# EAGLE design node2 (EAGLE 5.07)
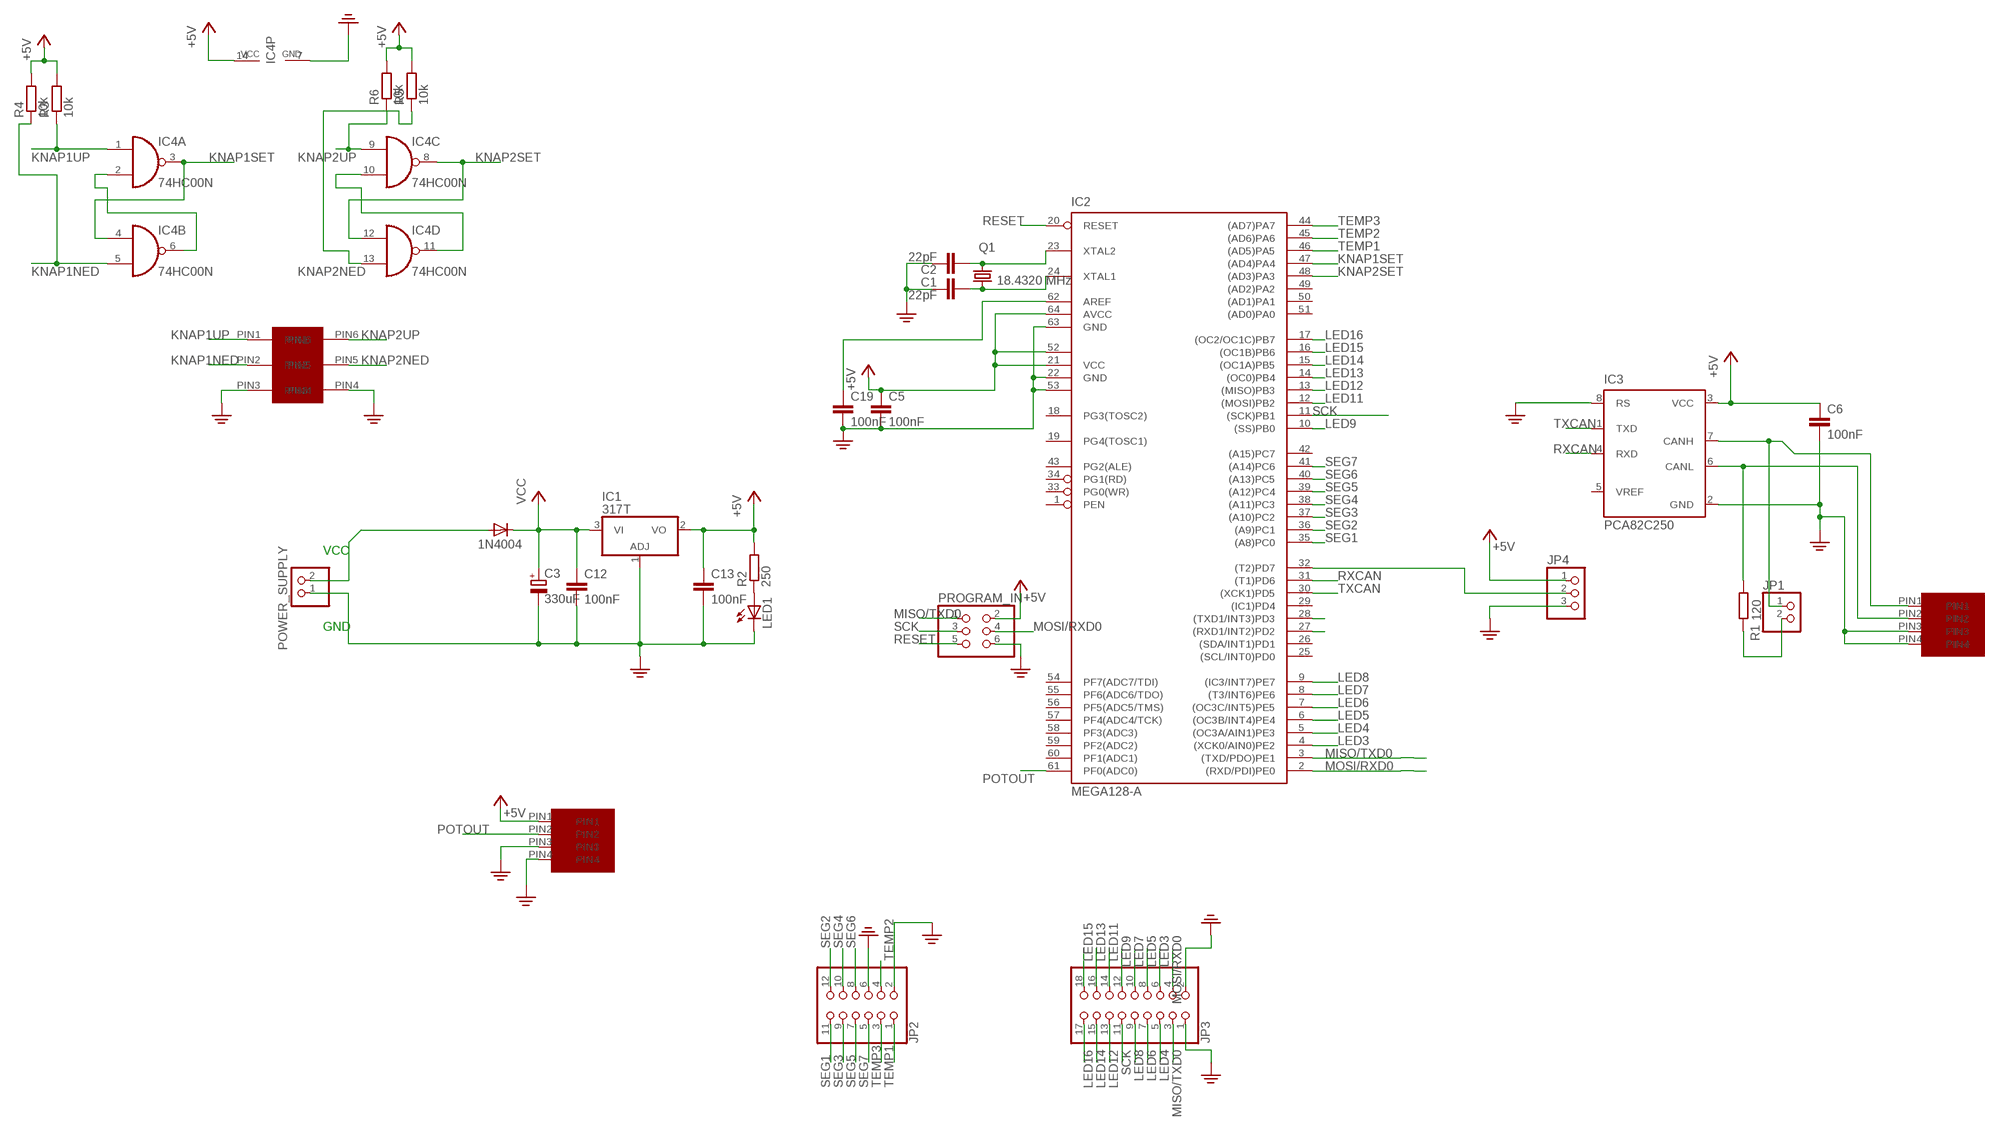
[diagram p0: schematic, sheet 1]

## Parts
C1  22pF  C5/2.5  [C5B2.5]
C2  22pF  C5/2.5  [C5B2.5]
C3  330uF  CPOL-EUE15-5AXIAL  [E15-5]
C5  100nF  C-EU050-024X044  [C050-024X044]
C6  100nF  C-EU050-024X044  [C050-024X044]
C12  100nF  C-EU050-024X044  [C050-024X044]
C13  100nF  C-EU050-024X044  [C050-024X044]
C19  100nF  C-EU050-024X044  [C050-024X044]
D1  1N4004  [DO41-10]
IC1  317T  [TO220H]
IC2  MEGA128-A  [TQFP64]
IC3  PCA82C250  [DIL08]
IC4  74HC00N  [DIL14]
JP1  PINHD-1X2  [1X02]
JP2  PINHD-2X6  [2X06]
JP3  PINHD-2X9  [2X09]
JP4  PINHD-1X3  [1X03]
LED1  LED5MM  [LED5MM]
POWER_SUPPLY  PINHD-1X2  [1X02]
PROGRAM_IN  PINHD-2X3  [2X03]
Q1  18.4320 MHz  CRYSTALHC49U70  [HC49U70]
R1  120  R-EU_0207/10  [0207/10]
R2  250  R-EU_0207/10  [0207/10]
R3  10k  R-EU_0207/10  [0207/10]
R4  10k  R-EU_0207/10  [0207/10]
R5  10k  R-EU_0207/10  [0207/10]
R6  10k  R-EU_0207/10  [0207/10]
U$1  MICROFIT4  [MICROFIT4SOCK]
U$4  MICROFIT6  [MICROFIT6SOCK]
U$5  MICROFIT4  [MICROFIT4SOCK]

## Nets
+5V: C5.1 C6.1 C13.1 IC1.2(VO) IC2.21(VCC) IC2.52(VCC1) IC2.64(AVCC) IC3.3(VCC) IC4.14(P:VCC) JP4.1 PROGRAM_IN.2 R2.2 R3.2 R4.2 R5.2 R6.2 U$5.PIN1
CANJUMP1: IC3.7(CANH) JP1.1 U$1.PIN1
CANJUMP2: JP1.2 R1.2
KNAP1NED: IC4.5(B:I1) R4.1 U$4.PIN2
KNAP1SET: IC2.47((AD4)PA4) IC4.3(A:O) IC4.4(B:I0)
KNAP1UP: IC4.1(A:I0) R3.1 U$4.PIN1
KNAP2NED: IC4.13(D:I1) R5.1 U$4.PIN5
KNAP2SET: IC2.48((AD3)PA3) IC4.8(C:O) IC4.12(D:I0)
KNAP2UP: IC4.9(C:I0) R6.1 U$4.PIN6
LED3: IC2.4((XCK0/AIN0)PE2) JP3.6
LED4: IC2.5((OC3A/AIN1)PE3) JP3.5
LED5: IC2.6((OC3B/INT4)PE4) JP3.8
LED6: IC2.7((OC3C/INT5)PE5) JP3.7
LED7: IC2.8((T3/INT6)PE6) JP3.10
LED8: IC2.9((IC3/INT7)PE7) JP3.9
LED9: IC2.10((SS)PB0) JP3.12
LED11: IC2.12((MOSI)PB2) JP3.14
LED12: IC2.13((MISO)PB3) JP3.13
LED13: IC2.14((OC0)PB4) JP3.16
LED14: IC2.15((OC1A)PB5) JP3.15
LED15: IC2.16((OC1B)PB6) JP3.18
LED16: IC2.17((OC2/OC1C)PB7) JP3.17
MISO/TXD0: IC2.3((TXD/PDO)PE1) JP3.3 PROGRAM_IN.1
MOSI/RXD0: IC2.2((RXD/PDI)PE0) JP3.4 PROGRAM_IN.4
N$1: C1.2 IC2.24(XTAL1) Q1.1
N$2: C2.2 IC2.23(XTAL2) Q1.2
N$4: IC2.32((T2)PD7) JP4.2
N$5: D1.A POWER_SUPPLY.2
N$6: LED1.A R2.1
N$7: IC2.27((RXD1/INT2)PD2)
N$10: C19.1 IC2.62(AREF)
N$12: IC2.28((TXD1/INT3)PD3)
N$13: IC4.2(A:I1) IC4.6(B:O)
N$15: IC4.10(C:I1) IC4.11(D:O)
N$51: IC3.6(CANL) R1.1 U$1.PIN2
PE: C1.1 C2.1 C3.- C5.2 C6.2 C12.2 C13.2 C19.2 IC1.1(ADJ) IC2.22(GND) IC2.53(GND1) IC2.63(GND) IC3.2(GND) IC3.8(RS) IC4.7(P:GND) JP2.2 JP2.6 JP3.1 JP3.2 JP4.3 LED1.K(C) POWER_SUPPLY.1 PROGRAM_IN.6 U$1.PIN3 U$1.PIN4 U$4.PIN3 U$4.PIN4 U$5.PIN3 U$5.PIN4
POTOUT: IC2.61(PF0(ADC0)) U$5.PIN2
RESET: IC2.20(RESET) PROGRAM_IN.5
RXCAN: IC2.31((T1)PD6) IC3.4(RXD)
SCK: IC2.11((SCK)PB1) JP3.11 PROGRAM_IN.3
SEG1: IC2.35((A8)PC0) JP2.11
SEG2: IC2.36((A9)PC1) JP2.12
SEG3: IC2.37((A10)PC2) JP2.9
SEG4: IC2.38((A11)PC3) JP2.10
SEG5: IC2.39((A12)PC4) JP2.7
SEG6: IC2.40((A13)PC5) JP2.8
SEG7: IC2.41((A14)PC6) JP2.5
TEMP1: IC2.46((AD5)PA5) JP2.1
TEMP2: IC2.45((AD6)PA6) JP2.4
TEMP3: IC2.44((AD7)PA7) JP2.3
TXCAN: IC2.30((XCK1)PD5) IC3.1(TXD)
VCC: C3.+ C12.1 D1.C IC1.3(VI)
Unconnected: IC2.1(PEN) IC2.18(PG3(TOSC2)) IC2.19(PG4(TOSC1)) IC2.25((SCL/INT0)PD0) IC2.26((SDA/INT1)PD1) IC2.29((IC1)PD4) IC2.33(PG0(WR)) IC2.34(PG1(RD)) IC2.42((A15)PC7) IC2.43(PG2(ALE)) IC2.49((AD2)PA2) IC2.50((AD1)PA1) IC2.51((AD0)PA0) IC2.54(PF7(ADC7/TDI)) IC2.55(PF6(ADC6/TDO)) IC2.56(PF5(ADC5/TMS)) IC2.57(PF4(ADC4/TCK)) IC2.58(PF3(ADC3)) IC2.59(PF2(ADC2)) IC2.60(PF1(ADC1)) IC3.5(VREF)

## Notes on the sheet
- VCC
- GND

## Library data of the parts
C1 C2 = capacitor-wima:C: CAPACITOR naming: grid - package width
C3 = rcl:CPOL-EU: POLARIZED CAPACITOR, European symbol
C5 C6 C12 C13 C19 = rcl:C-EU: CAPACITOR, European symbol
D1 = diode:1N4004: DIODE general purpose rectifier, 1 A
IC1 = linear:*317: Positive VOLTAGE REGULATOR
IC2 = atmel:MEGA128: MICROCONTROLLER 128 Kbytes FLASH 4 Kbytes SRAM 4 Kbytes EEPROM DUAL USART 8-channel 10 bit ADC Source: avr.lbr
IC3 = micro-philips:PCA82C250: CAN CONTROLLER INTERFACE
IC4 = 74xx-eu:74*00: Quad 2-input NAND gate
JP1 POWER_SUPPLY = pinhead:PINHD-1X2: PIN HEADER
JP2 = pinhead:PINHD-2X6: PIN HEADER
JP3 = pinhead:PINHD-2X9: PIN HEADER
JP4 = pinhead:PINHD-1X3: PIN HEADER
LED1 = led:LED: LED OSRAM: - CHIPLED LG R971, LG N971, LY N971, LG Q971, LY Q971, LO R971, LY R971 LH N974, LH R974 LS Q976, LO Q976, LY Q976 LO Q996 - Hyper CHIPLED LW Q18S LB Q993, LB Q99A, LB R99A - SideLED LS A670, LO A670, LY A670, LG A670, LP A670 LB A673, LV A673, LT A673, LW A673 LH A674 LY A675 LS A676, LA A676, LO A676, LY A676, LW A676 LS A679, LY A679, LG A679 - Hyper Micro SIDELED® LS Y876, LA Y876, LO Y876, LY Y876 LT Y87S - SmartLED LW L88C, LW L88S LB L89C, LB L89S, LG L890 LS L89K, LO L89K, LY L89K LS L896, LA L896, LO L896, LY L896 - TOPLED LS T670, LO T670, LY T670, LG T670, LP T670 LSG T670, LSP T670, LSY T670, LOP T670, LYG T670 LG T671, LOG T671, LSG T671 LB T673, LV T673, LT T673, LW T673 LH T674 LS T676, LA T676, LO T676, LY T676, LB T676, LH T676, LSB T676, LW T676 LB T67C, LV T67C, LT T67C, LS T67K, LO T67K, LY T67K, LW E67C LS E67B, LA E67B, LO E67B, LY E67B, LB E67C, LV E67C, LT E67C LW T67C LS T679, LY T679, LG T679 LS T770, LO T770, LY T770, LG T770, LP T770 LB T773, LV T773, LT T773, LW T773 LH T774 LS E675, LA E675, LY E675, LS T675 LS T776, LA T776, LO T776, LY T776, LB T776 LHGB T686 LT T68C, LB T68C - Hyper Mini TOPLED® LB M676 - Mini TOPLED Santana® LG M470 LS M47K, LO M47K, LY M47K Source: http://www.osram.convergy.de LUXEON: - LUMILED® LXK2-PW12-R00, LXK2-PW12-S00, LXK2-PW14-U00, LXK2-PW14-V00 LXK2-PM12-R00, LXK2-PM12-S00, LXK2-PM14-U00 LXK2-PE12-Q00, LXK2-PE12-R00, LXK2-PE12-S00, LXK2-PE14-T00, LXK2-PE14-U00 LXK2-PB12-K00, LXK2-PB12-L00, LXK2-PB12-M00, LXK2-PB14-N00, LXK2-PB14-P00, LXK2-PB14-Q00 LXK2-PR12-L00, LXK2-PR12-M00, LXK2-PR14-Q00, LXK2-PR14-R00 LXK2-PD12-Q00, LXK2-PD12-R00, LXK2-PD12-S00 LXK2-PH12-R00, LXK2-PH12-S00 LXK2-PL12-P00, LXK2-PL12-Q00, LXK2-PL12-R00 Source: www.luxeon.com KINGBRIGHT: KA-3528ASYC Source: www.kingbright.com
PROGRAM_IN = pinhead:PINHD-2X3: PIN HEADER
Q1 = crystal:CRYSTAL: CRYSTAL
R1-R6 = resistor:R-EU_: RESISTOR, European symbol
U$1 U$5 = UNICORN:MICROFIT4
U$4 = UNICORN:MICROFIT6

## Board
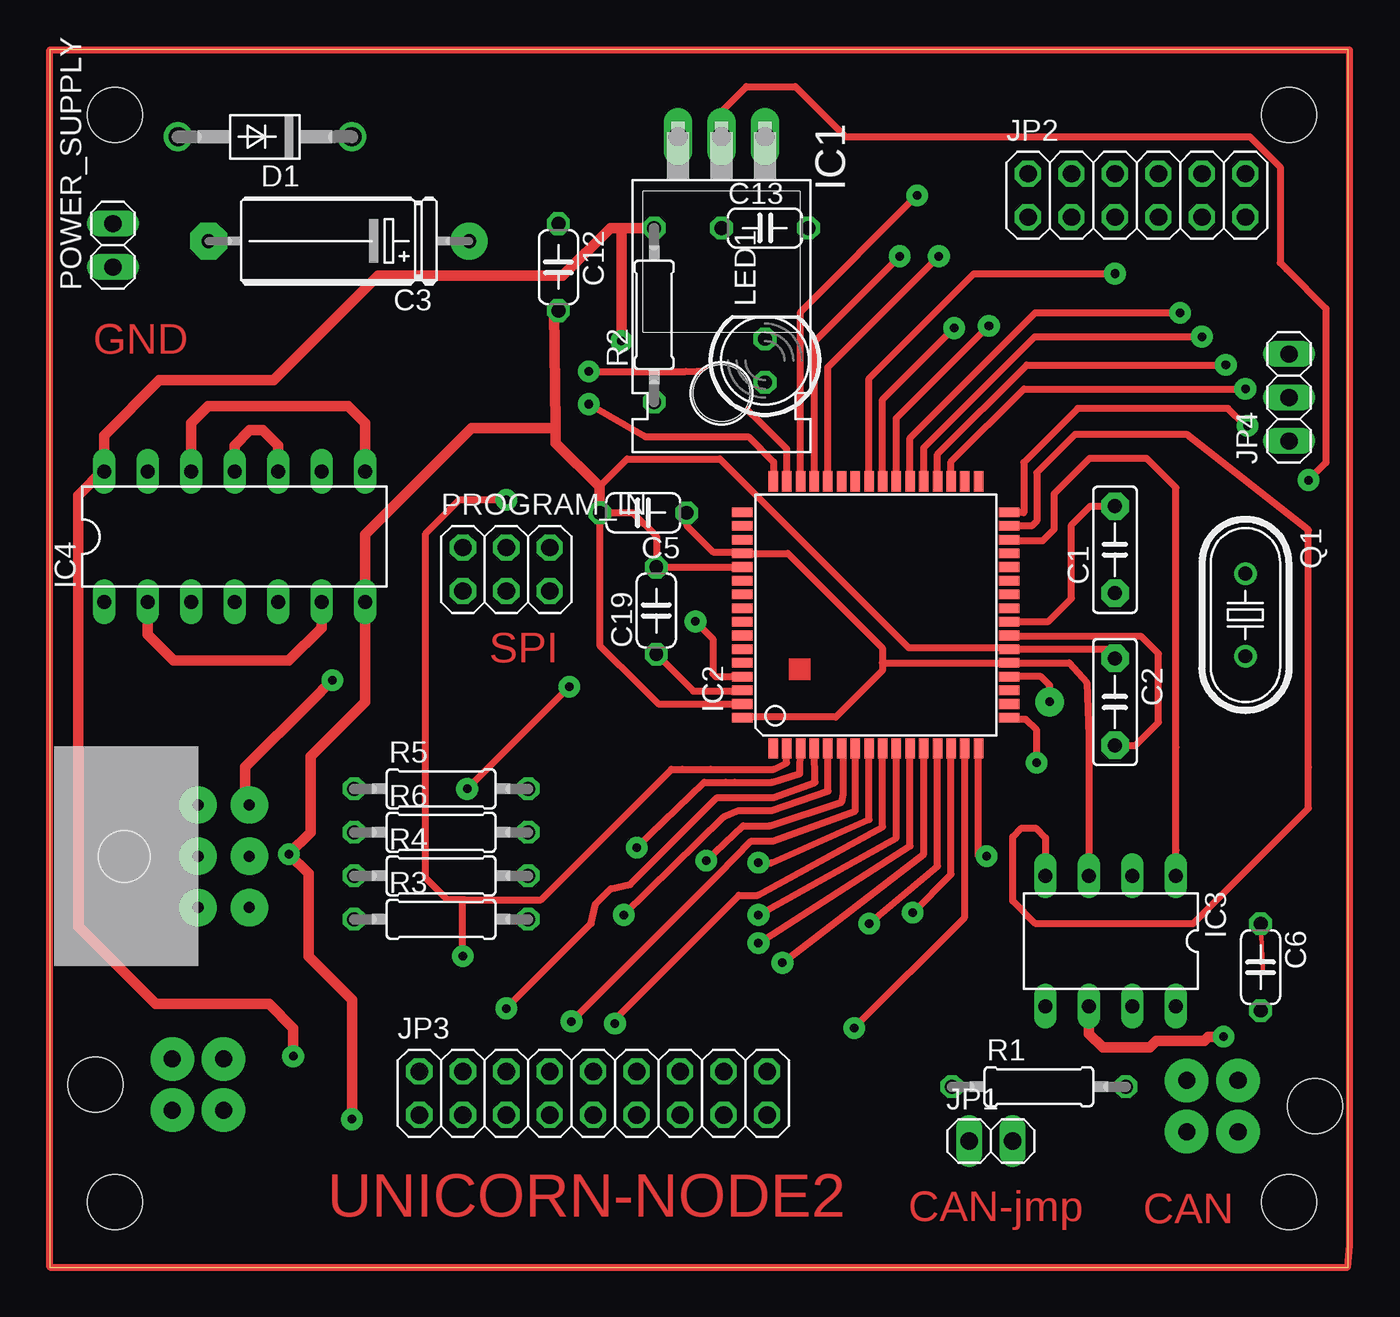
[diagram p1: board, top side]
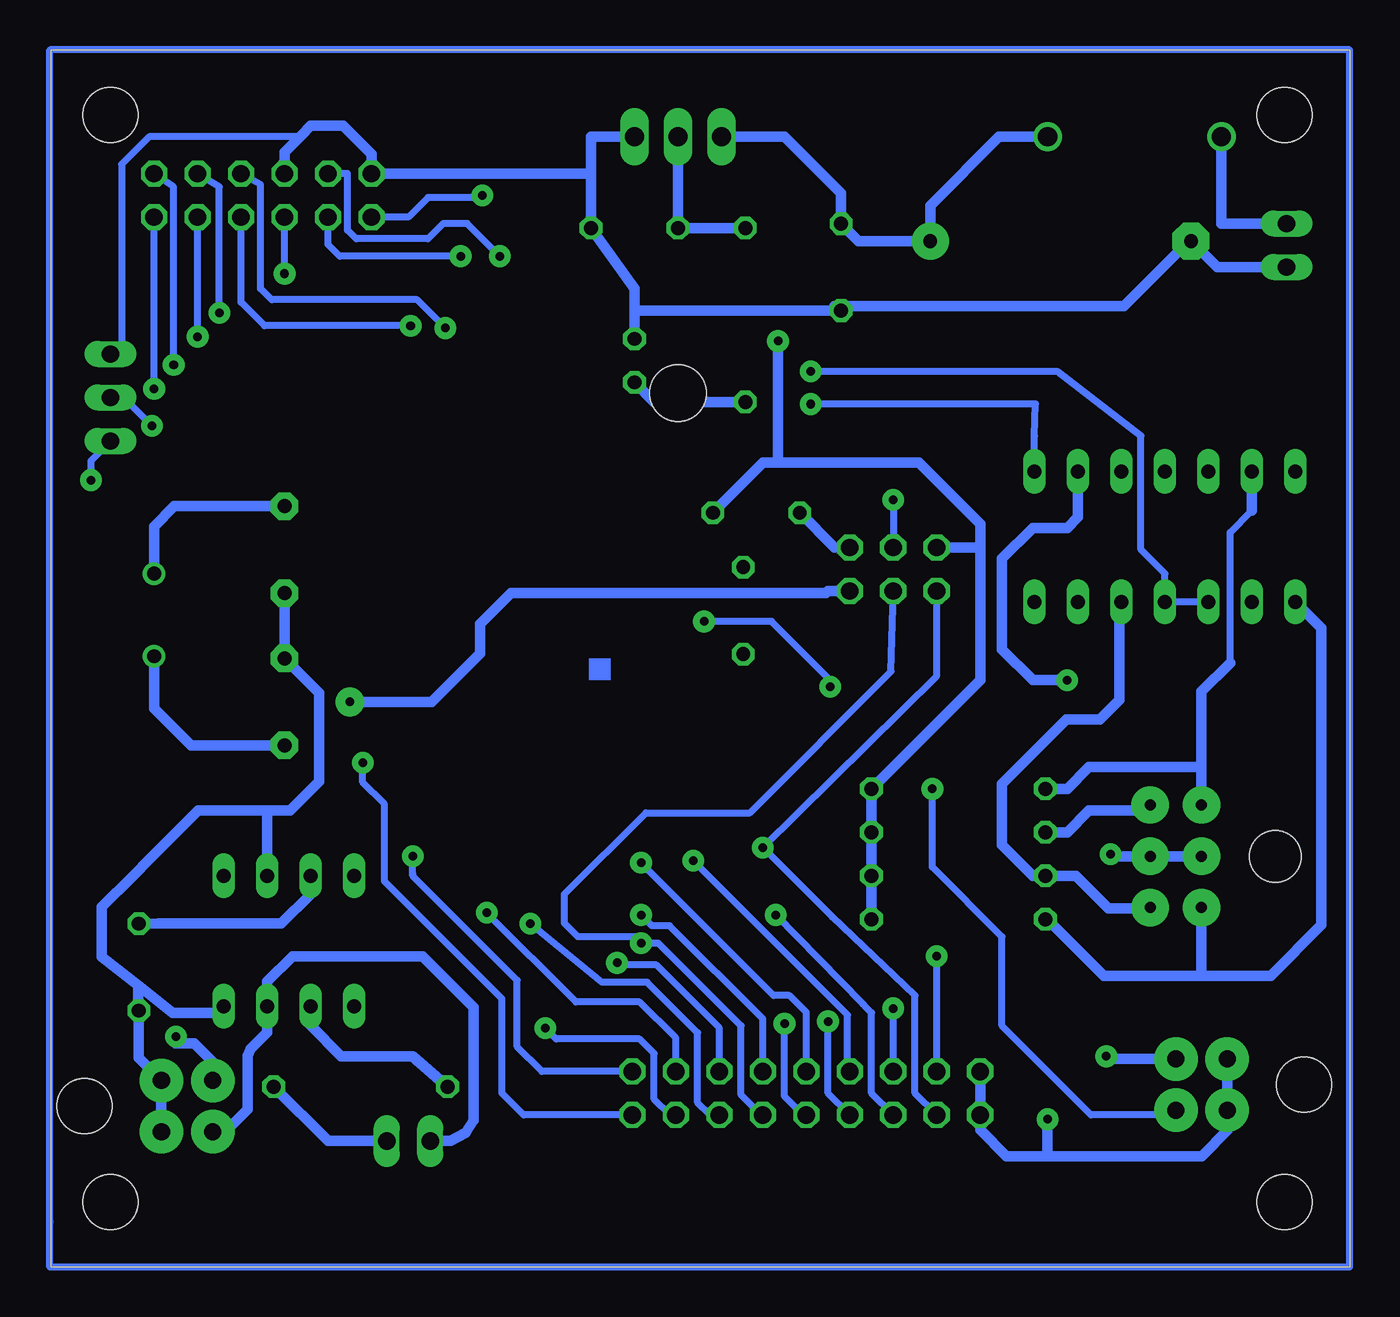
[diagram p2: board, bottom side, seen from below]

Size 75.87 x 71.11 mm. Coordinates in mm from the lower left corner, seen from the top.
Outline: 0,0 75.87,0 75.87,71.11 0,71.11 0,0
Copper layers (1*16): Top 0.035mm / dielectric 1.5mm / Bottom 0.035mm
Design rules "default": minimum track width 10mil, minimum drill 24mil, track to track 8mil, track to pad 8mil, pad to pad 8mil, via to via 8mil, smd to smd 8mil, copper to edge 40mil, drill to drill 8mil, minimum pad ring 10mil, minimum via ring 8mil, stop-mask expansion 4mil, vias tented up to drill 0mil, thermal gap 10mil
Holes 3.2 mm at 3.81,3.81 3.81,67.31 72.39,67.31 72.39,3.81

### Footprints (pad centres in the part's own frame; a part is rotated, then mirrored left to right if it is on the bottom)
C5B2.5 = drill 0.813 pad 1.6 octagon: 1 -2.54,0; 2 2.54,0
E15-5 = drill 0.813 pad 2.159 round: + -7.62,0 | drill 0.813 pad 2.159 octagon: - 7.62,0
C050-024X044 = drill 0.813 octagon: 1 -2.54,0; 2 2.54,0
DO41-10 = drill 1.118 round: A 5.08,0; C -5.08,0
TO220H = drill 1.118 long: 1 -2.54,-10.16; 2 0,-10.16; 3 2.54,-10.16 | hole 3.302: 0,4.826
TQFP64 = smd 1.194 x 0.559: 1 -7.8,6; 2 -7.8,5.2; 3 -7.8,4.4; 4 -7.8,3.6; 5 -7.8,2.8; 6 -7.8,2; 7 -7.8,1.2; 8 -7.8,0.4; 9 -7.8,-0.4; 10 -7.8,-1.2; 11 -7.8,-2; 12 -7.8,-2.8; 13 -7.8,-3.6; 14 -7.8,-4.4; 15 -7.8,-5.2; 16 -7.8,-6; 33 7.8,-6; 34 7.8,-5.2; 35 7.8,-4.4; 36 7.8,-3.6; 37 7.8,-2.8; 38 7.8,-2; 39 7.8,-1.2; 40 7.8,-0.4; 41 7.8,0.4; 42 7.8,1.2; 43 7.8,2; 44 7.8,2.8; 45 7.8,3.6; 46 7.8,4.4; 47 7.8,5.2; 48 7.8,6 | smd 0.559 x 1.194: 17 -6,-7.8; 18 -5.2,-7.8; 19 -4.4,-7.8; 20 -3.6,-7.8; 21 -2.8,-7.8; 22 -2,-7.8; 23 -1.2,-7.8; 24 -0.4,-7.8; 25 0.4,-7.8; 26 1.2,-7.8; 27 2,-7.8; 28 2.8,-7.8; 29 3.6,-7.8; 30 4.4,-7.8; 31 5.2,-7.8; 32 6,-7.8; 49 6,7.8; 50 5.2,7.8; 51 4.4,7.8; 52 3.6,7.8; 53 2.8,7.8; 54 2,7.8; 55 1.2,7.8; 56 0.4,7.8; 57 -0.4,7.8; 58 -1.2,7.8; 59 -2,7.8; 60 -2.8,7.8; 61 -3.6,7.8; 62 -4.4,7.8; 63 -5.2,7.8; 64 -6,7.8
DIL08 = drill 0.813 long: 1 -3.81,-3.81; 2 -1.27,-3.81; 3 1.27,-3.81; 4 3.81,-3.81; 5 3.81,3.81; 6 1.27,3.81; 7 -1.27,3.81; 8 -3.81,3.81
DIL14 = drill 0.813 long: 1 -7.62,-3.81; 2 -5.08,-3.81; 3 -2.54,-3.81; 4 0,-3.81; 5 2.54,-3.81; 6 5.08,-3.81; 7 7.62,-3.81; 8 7.62,3.81; 9 5.08,3.81; 10 2.54,3.81; 11 0,3.81; 12 -2.54,3.81; 13 -5.08,3.81; 14 -7.62,3.81
1X02 = drill 1.016 long: 1 -1.27,0; 2 1.27,0
2X06 = drill 1.016 octagon: 1 -6.35,-1.27; 2 -6.35,1.27; 3 -3.81,-1.27; 4 -3.81,1.27; 5 -1.27,-1.27; 6 -1.27,1.27; 7 1.27,-1.27; 8 1.27,1.27; 9 3.81,-1.27; 10 3.81,1.27; 11 6.35,-1.27; 12 6.35,1.27
2X09 = drill 1.016 octagon: 1 -10.16,-1.27; 2 -10.16,1.27; 3 -7.62,-1.27; 4 -7.62,1.27; 5 -5.08,-1.27; 6 -5.08,1.27; 7 -2.54,-1.27; 8 -2.54,1.27; 9 0,-1.27; 10 0,1.27; 11 2.54,-1.27; 12 2.54,1.27; 13 5.08,-1.27; 14 5.08,1.27; 15 7.62,-1.27; 16 7.62,1.27; 17 10.16,-1.27; 18 10.16,1.27
1X03 = drill 1.016 long: 1 -2.54,0; 2 0,0; 3 2.54,0
LED5MM = drill 0.813 octagon: A -1.27,0; K 1.27,0
2X03 = drill 1.016 octagon: 1 -2.54,-1.27; 2 -2.54,1.27; 3 0,-1.27; 4 0,1.27; 5 2.54,-1.27; 6 2.54,1.27
HC49U70 = drill 0.813 round: 1 -2.413,0; 2 2.413,0
0207/10 = drill 0.813 octagon: 1 -5.08,0; 2 5.08,0
MICROFIT4SOCK = drill 1 pad 2.54 round: PIN1 -2,0; PIN2 1,0; PIN3 -2,-3; PIN4 1,-3 | hole 3.2: -0.5,-7.5
MICROFIT6SOCK = drill 0.64 pad 2.184 round: PIN1 3,-1.5; PIN2 3,1.5; PIN3 0,-1.5; PIN4 0,1.5; PIN5 -3,-1.5; PIN6 -3,1.5 | hole 3: 0,-5.8

### Placement (x,y rotation side)
C1  62.23,41.91 90 top
C2  62.23,33.02 270 top
C3  16.89,59.94 180 top
C5  34.67,44.07 180 top
C6  70.74,17.53 270 top
C12  29.72,58.42 270 top
C13  41.78,60.71 0 top
C19  35.43,38.35 90 top
D1  12.57,66.04 180 top
IC1  39.24,55.88 180 top
IC2  48.26,38.1 90 top
IC3  61.98,19.05 180 top
IC4  10.79,42.67 0 top
JP1  54.99,7.37 0 top
JP2  63.5,62.61 0 top
JP3  31.75,10.16 0 top
JP4  72.39,50.8 90 top
LED1  41.78,52.96 90 top
POWER_SUPPLY  3.68,59.69 90 top
PROGRAM_IN  26.67,40.77 0 top
Q1  69.85,38.1 270 top
R1  57.78,10.54 0 top
R2  35.31,55.63 90 top
R3  22.86,20.32 0 top
R4  22.86,22.86 0 top
R5  22.86,27.94 0 top
R6  22.86,25.4 0 top
U$1  66.42,9.91 90 top
U$4  10.16,24 270 top
U$5  10.16,10.16 270 top

### Tracks (layer width: path | path; a pad name or v marks a point on that pad's centre or on a via)
+5V  (via drill 0.5 pad 1.27)
  Top 0.254: C6.1 70.87,17.4
  Top 0.406: C5.1 37.21,43.33 38.76,41.78 40.46,41.78 IC2.52 43.12,41.7 48.64,36.17 48.64,35.31 | IC2.21 59.56,35.31 60.58,34.16 60.71,31.01 60.71,24.25 IC3.3 60.71,23.98 | IC2.21 | 48.64,35.31 IC2.21 | 40.46,32.13 IC2.64 40.46,32.13 | 40.46,32.13 45.92,32.13 48.64,34.85 48.64,35.31 | v73.53,45.97 74.55,46.99 74.55,48.26 74.55,56.01 72.26,58.29 71.88,58.67 71.88,64.27 70.11,66.04 46.48,66.04 46.1,66.42 43.56,68.96 40.69,68.96 39.24,67.51 IC1.2
  Top 0.61: 33.4,60.71 32.77,60.71 29.97,57.91 19.18,57.91 13.08,51.82 6.41,51.82 3.17,48.58 IC4.14 3.17,46.61 1.65,45.09 1.65,19.92 6.2,15.37 12.8,15.37 14.22,13.95 v14.22,12.32 | 33.4,60.71 R2.2 | 33.4,60.71 v33.4,54.1
  Bottom 0.406: v73.53,45.97 73.53,47.12 JP4.1
  Bottom 0.61: C13.1 IC1.2 C13.1 | R2.2 C13.1 | C6.1 70.61,20.06 69.59,20.07 62.41,20.07 60.71,21.78 IC3.3 | R3.2 R4.2 R6.2 R5.2 21.59,34.29 21.59,41.91 | 21.59,41.91 21.59,43.4 25.18,46.99 33.4,46.99 | 33.4,46.99 34.29,46.99 | 34.29,46.99 C5.1 | PROGRAM_IN.2 21.59,42.04 21.59,41.91 | U$5.PIN1 14.22,12.16 v14.22,12.32 | 33.4,46.99 34.29,46.99 | v33.4,54.1 33.4,46.99
CANJUMP1
  Bottom 0.61: JP1.1 52.52,7.37 51.65,7.84 51.18,8.58 51.18,15.19 54.16,18.16 61.77,18.16 63.25,16.68 IC3.7 63.25,13.72 64.22,12.74 64.39,12.34 64.39,9.22 65.71,7.91 U$1.PIN1
CANJUMP2
  Bottom 0.61: JP1.2 59.69,7.37 R1.2
KNAP1NED
  Bottom 0.61: IC4.5 13.46,38.86 13.46,33.14 14.6,32 16.54,32 20.32,28.23 20.32,24.66 18.52,22.86 R4.1 16,22.86 14.1,20.96 11.66,20.96 U$4.PIN2
KNAP1SET  (via drill 0.5 pad 1.27)
  Top 0.406: IC2.47 43.05,47.81 41.46,49.4 38.35,52.38 37.14,52.32 v31.5,52.32
  Bottom 0.406: v31.5,52.32 24.64,52.32 17.09,52.32 12.19,48.56 12.19,41.91 10.79,40.51 IC4.4 IC4.3
KNAP1UP
  Bottom 0.61: IC4.1 1.65,37.34 1.65,19.98 4.62,17.02 8.66,17.02 | 8.66,17.02 U$4.PIN1 | R3.1 17.65,20.32 14.35,17.02 8.66,17.02
KNAP2NED
  Bottom 0.406: 6.99,35.31 6.99,42.93 5.71,44.2
  Bottom 0.61: 5.71,44.2 IC4.13 | U$4.PIN5 8.66,29.21 | 8.66,29.21 8.66,33.63 6.99,35.31 | R5.1 16.51,27.94 15.24,29.21 8.66,29.21
KNAP2SET  (via drill 0.5 pad 1.27)
  Top 0.406: IC2.48 42.29,45.9 42.29,47.03 40.81,48.51 34.8,48.51 v31.5,50.42
  Top 0.61: IC4.12 8.26,49.3 9.25,50.29 17.42,50.29 18.41,49.3 IC4.8
  Bottom 0.406: v31.5,50.42 22.48,50.42 18.36,50.42 18.41,48.56 IC4.8
KNAP2UP  (via drill 0.5 pad 1.27)
  Top 0.61: U$4.PIN6 11.43,27 11.43,29.21 15.24,33.02 v16.51,34.29
  Bottom 0.61: R6.1 16.51,25.4 15.24,26.67 11.66,26.67 U$4.PIN6 | v16.51,34.29 18.52,34.29 20.32,36.09 20.32,41.38 18.52,43.18 16.51,43.18 15.88,43.81 IC4.9
LED3  (via drill 0.5 pad 1.27)
  Top 0.406: v26.67,15.11 31.62,20.07 31.88,21.21 32.77,22.1 33.91,22.35 38.99,27.43 42.29,27.43 44.7,28.32 IC2.4
  Bottom 0.406: JP3.6 v26.67,15.11
LED4  (via drill 0.5 pad 1.27)
  Top 0.406: IC2.5 45.47,27.81 42.16,26.67 40.26,26.67 39.37,26.29 v33.53,20.57
  Bottom 0.406: v33.53,20.57 28.45,15.37 28.19,15.11 27.94,14.86 27.94,10.16 JP3.5
LED5  (via drill 0.5 pad 1.27)
  Top 0.406: IC2.6 46.35,30.3 46.35,27.64 46.27,27.18 42.04,25.78 40.51,25.78 v38.35,23.75
  Bottom 0.406: JP3.8 29.34,11.43 29.34,14.73 30.61,16 v38.35,23.75
LED6  (via drill 0.5 pad 1.27)
  Top 0.406: v30.48,14.35 39.1,22.97 40.98,24.89 42.25,24.89 47.06,26.65 IC2.7
  Bottom 0.406: JP3.7 30.48,10.16 v30.48,14.35
LED7  (via drill 0.5 pad 1.27)
  Top 0.406: v41.4,23.62 42.16,23.62 47.86,26.15 IC2.8
  Bottom 0.406: JP3.10 31.75,14.88 32.74,15.87 33.66,15.87 v41.4,23.62
LED8  (via drill 0.5 pad 1.27)
  Top 0.406: 48.66,29.86 IC2.9 48.66,25.72 41.36,21.72 40.26,21.72 33.15,14.6 v33.02,14.22
  Bottom 0.406: JP3.9 31.93,8.89 33.02,9.97 v33.02,14.22
LED9  (via drill 0.5 pad 1.27)
  Top 0.406: v41.4,20.57 49.46,25.08 IC2.10
  Bottom 0.406: JP3.12 34.29,14.5 39.73,19.94 40.77,19.94 v41.4,20.57
LED11  (via drill 0.5 pad 1.27)
  Top 0.406: v42.8,17.78 51.06,24.14 IC2.12
  Bottom 0.406: JP3.14 36.83,13.97 40.51,17.65 42.67,17.65 v42.8,17.78
LED12  (via drill 0.5 pad 1.27)
  Top 0.406: v47.88,20.07 51.86,23.41 IC2.13
  Bottom 0.406: JP3.13 37.38,8.89 38.1,9.61 38.1,13.69 41.05,16.64 43.69,16.64 v47.88,20.07
LED13  (via drill 0.5 pad 1.27)
  Top 0.406: v50.42,20.7 52.66,22.94 IC2.14
  Bottom 0.406: JP3.16 39.37,13.38 41.48,15.49 45.21,15.49 v50.42,20.7
LED14  (via drill 0.5 pad 1.27)
  Top 0.406: v46.99,13.97 53.46,20.44 IC2.15
  Bottom 0.406: JP3.15 39.72,8.89 40.64,9.81 40.64,12.48 41.49,13.33 46.35,13.33 v46.99,13.97
LED15  (via drill 0.5 pad 1.27)
  Top 0.406: v54.74,24 54.26,24 IC2.16
  Bottom 0.406: JP3.18 47.19,11.43 48.64,12.88 48.64,16.76 54.74,22.86 54.74,22.99 v54.74,24
LED16  (via drill 0.5 pad 1.27)
  Top 0.406: v57.66,29.46 57.66,31.37 57.02,32 56.06,32 IC2.17
  Bottom 0.406: JP3.17 48.26,8.89 49.53,10.16 49.53,15.68 54.05,20.19 56.39,22.54 56.39,27.05 57.66,28.32 v57.66,29.46
MISO/TXD0  (via drill 0.5 pad 1.27)
  Top 0.406: IC2.3 43.81,28.83 42.16,28.32 40.01,28.32 39.5,28.32 38.23,28.32 v34.29,24.51
  Bottom 0.406: JP3.3 25.4,10.16 25.4,15.87 30.23,20.45 v34.29,24.51 24.13,34.54 PROGRAM_IN.1
MOSI/RXD0  (via drill 0.5 pad 1.27)
  Top 0.406: IC2.2 43.05,29.46 42.29,29.08 38.61,29.08 36.96,29.08 36.32,29.08 28.7,21.46 25.53,21.46 24.26,21.46 | 24.26,21.46 24.13,21.46 v24.13,18.16 | v26.67,44.83 23.95,44.83 21.97,42.85 21.97,22.74 23.25,21.46 24.26,21.46
  Bottom 0.406: JP3.4 v24.13,18.16 | v26.67,44.83 PROGRAM_IN.4
N$1
  Top 0.406: C1.2 60.78,44.45 59.69,43.36 59.69,39.07 58.34,37.72 56.06,37.72 IC2.24
  Bottom 0.61: C1.2 68.68,44.45 69.85,43.28 Q1.1
N$2
  Top 0.406: 56.06,36.83 IC2.23 56.06,36.83 | C2.2 63.42,30.48 64.77,31.83 64.77,35.84 63.78,36.83 56.06,36.83
  Bottom 0.61: C2.2 67.69,30.48 69.85,32.64 Q1.2
N$3  (via drill 0.5 pad 1.68)
  other vias: 58.42,33.02
N$4  (via drill 0.5 pad 1.27)
  Top 0.406: v69.98,49.15 69.85,49.15 68.83,50.16 60.05,50.16 56.9,47.01 56.9,44.07 56.06,44.07 IC2.32
  Bottom 0.406: v69.98,49.15 71.63,50.8 JP4.2
N$5
  Bottom 0.61: POWER_SUPPLY.2 7.49,60.96 D1.A
N$6
  Bottom 0.61: R2.1 40.64,50.55 LED1.A
N$9
  Top 0.406: 0,71.12 75.95,71.12 75.95,1.27 75.82,0 0,0 0,71.12
N$10
  Top 0.406: C19.1 35.56,35.81 35.56,35.7 37.61,33.66 40.46,33.66 IC2.62
N$11
  Bottom 0.406: 75.95,0 0,0 0,71.12 75.95,71.12 75.95,2.67 | 75.95,0 75.95,2.67 | 75.95,0 75.95,2.67 | 75.95,0 75.95,2.67
N$13
  Top 0.61: IC4.6 15.88,37.34 13.97,35.43 7.25,35.43 5.71,36.97 IC4.2
N$15
  Top 0.61: IC4.11 10.79,48 11.69,48.89 12.44,48.89 13.34,48 IC4.10
N$51  (via drill 0.5 pad 1.27)
  Top 0.61: v68.58,13.46 67.69,13.46 67.44,13.21 64.64,13.21 64.26,12.83 61.52,12.83 60.71,13.64 60.71,14.6 IC3.6
  Bottom 0.61: IC3.6 60.71,14.12 58.91,12.32 54.74,12.32 R1.1 | U$1.PIN2 66.42,11.99 67.51,13.08 68.58,13.08 v68.58,13.46
PE  (via drill 0.5 pad 1.27)
  Top 0.406: IC2.53 C19.2 35.43,42.7 34.06,44.07 C5.2 31.88,44.07 | IC2.63 35.56,32.9 34.55,33.91 32.13,36.33 32.13,43.94 | 31.88,44.07 32.13,43.94 | 31.88,44.07 32.13,43.94 | 31.88,44.07 32.13,45.61 33.74,47.22 39.14,47.22 50.16,36.2 56.06,36.2 IC2.22 62.23,36.1 C2.1
  Top 0.61: C12.2 29.46,55.88 29.55,49.15 | C5.2 32.13,45.61 29.56,48.14 29.55,49.15 | 29.55,49.15 29.42,49.02 24.64,49.02 18.41,42.8 IC4.7 18.41,33.02 15.24,29.85 15.24,25.4 v13.97,24.13 15.11,22.99 15.11,18.16 17.65,15.62 v17.65,8.64
  Bottom 0.406: JP4.3 71.75,53.34 71.75,64.42 70.14,66.04 61.27,66.04 61.27,66.1
  Bottom 0.61: 44.32,63.75 C13.2 41.78,57.15 LED1.K 41.78,55.88 C12.2 30.1,56.13 13.21,56.13 9.4,59.94 C3.- 7.75,58.42 POWER_SUPPLY.1 | 44.32,63.75 44.32,66.04 IC1.1 | C1.1 C2.1 60.2,33.53 60.2,28.38 61.91,26.67 62.99,26.67 | 70.77,16.45 72.9,18.12 72.9,21.04 71.08,22.86 70.1,23.84 67.27,26.67 62.99,26.67 | 70.77,16.45 68.75,14.86 65.79,14.86 IC3.8 | IC3.2 63.25,25.02 63.25,26.67 62.99,26.67 | C5.2 30.1,42.04 PROGRAM_IN.6 | U$1.PIN3 U$1.PIN4 70.74,12.22 C6.2 70.77,14.99 70.77,16.45 | JP2.6 62.23,65.14 61.27,66.1 60.7,66.67 58.81,66.67 57.15,65.02 JP2.2 44.32,63.88 44.32,63.75 | 13.97,24 U$4.PIN4 | U$4.PIN4 U$4.PIN3 | v13.97,24.13 13.97,24 | JP3.2 JP3.1 21.59,8.01 20.06,6.48 17.65,6.48 | U$5.PIN3 U$5.PIN4 7.11,9.16 7.11,8.01 8.65,6.48 17.65,6.48 | 17.65,6.48 v17.65,8.64 | 13.97,24 U$4.PIN4
POTOUT  (via drill 0.5 pad 1.27)
  Top 0.406: IC2.61 38.91,34.5 38.73,34.67 38.73,36.7 v37.72,37.72 | v30.35,33.91 29.34,32.89 v24.38,27.94
  Bottom 0.406: v37.72,37.72 33.78,37.72 31.62,35.56 30.23,34.16 v30.35,33.91 | v24.38,27.94 24.38,23.37 20.32,19.3 20.32,14.1 19.3,13.08 15.11,8.89 10.16,8.89 U$5.PIN2
RESET  (via drill 0.5 pad 1.68)
  Top 0.406: v58.42,33.02 58.42,33.99 57.91,34.5 IC2.20
  Bottom 0.61: v58.42,33.02 53.64,33.02 50.8,35.86 50.8,37.57 49,39.37 30.61,39.37 30.48,39.5 PROGRAM_IN.5
RXCAN
  Top 0.406: 58.29,22.86 IC3.4 58.17,25.09 57.6,25.65 56.77,25.65 56.26,25.15 56.26,21.39 57.56,20.09 60.61,20.07 63.12,20.07 66.8,20.07 73.53,26.8 73.53,29.21 73.53,43.05 66.42,48.64 59.89,48.64 57.66,46.41 57.66,43.59 57.37,43.31 IC2.31
SCK  (via drill 0.5 pad 1.27)
  Top 0.406: v41.4,18.92 50.26,24.61 IC2.11
  Bottom 0.406: JP3.11 34.39,8.89 35.56,10.06 35.56,14.1 40.39,18.92 v41.4,18.92 41.78,19.3 45.09,19.3 45.87,20.09 45.87,21.79 41.12,26.54 35.05,26.54 26.8,34.8 PROGRAM_IN.3
SEG1  (via drill 0.5 pad 1.27)
  Top 0.406: v69.85,51.31 56.92,51.31 52.66,47.05 IC2.35
  Bottom 0.406: JP2.11 69.85,55.12 v69.85,51.31
SEG2  (via drill 0.5 pad 1.27)
  Top 0.406: v68.71,52.7 57.07,52.7 51.86,47.49 IC2.36
  Bottom 0.406: JP2.12 68.71,63.12 v68.71,52.7
SEG3  (via drill 0.5 pad 1.27)
  Top 0.406: v67.31,54.36 57.54,54.36 51.06,47.87 IC2.37
  Bottom 0.406: v67.31,54.36 JP2.9
SEG4  (via drill 0.5 pad 1.27)
  Top 0.406: v66.04,55.75 57.57,55.75 50.26,48.44 IC2.38
  Bottom 0.406: v66.04,55.75 66.04,63.12 JP2.10
SEG5  (via drill 0.5 pad 1.27)
  Top 0.406: v54.86,54.99 49.46,49.59 IC2.39
  Bottom 0.406: JP2.7 64.77,56.77 64.77,56.36 63.4,54.99 v54.86,54.99
SEG6  (via drill 0.5 pad 1.27)
  Top 0.406: v52.83,54.86 48.66,50.69 IC2.40
  Bottom 0.406: JP2.8 63.63,63.25 63.63,57.16 62.98,56.52 54.48,56.52 v52.83,54.86
SEG7  (via drill 0.5 pad 1.27)
  Top 0.406: v62.23,58.04 53.98,58.04 47.86,51.92 IC2.41
  Bottom 0.406: v62.23,58.04 JP2.5
TEMP1  (via drill 0.5 pad 1.27)
  Top 0.406: v50.67,62.61 43.86,55.8 IC2.46
  Bottom 0.406: JP2.1 54.99,61.34 53.85,62.48 50.67,62.48 v50.67,62.61
TEMP2  (via drill 0.5 pad 1.27)
  Top 0.406: v49.66,59.05 44.66,54.06 IC2.45
  Bottom 0.406: JP2.4 58.55,63.88 58.55,60.58 58.04,60.07 53.85,60.07 52.96,60.96 51.56,60.96 v49.66,59.05
TEMP3  (via drill 0.5 pad 1.27)
  Top 0.406: v51.94,59.05 45.46,52.57 IC2.44
  Bottom 0.406: JP2.3 59.69,59.74 59.01,59.05 v51.94,59.05
TXCAN
  Top 0.406: IC2.30 56.06,42.42 57.99,42.42 58.67,43.1 58.67,45.18 60.74,47.24 64.08,47.24 65.79,45.54 65.79,30.38 65.79,24.36 IC3.1
VCC
  Bottom 0.61: D1.C 20.5,66.04 24.51,62.02 C3.+ 28.7,59.94 C12.1 29.72,62.75 33.01,66.04 IC1.3
(copper drawn outside any net)
  shapes: Bottom area x1, Bottom circle x5, Top area x1, Top circle x5

### Text on the board
Top: GND | SPI | UNICORN-NODE2 | CAN-jmp | CAN